# Altium schematic sheet rf.SchDoc
size A4
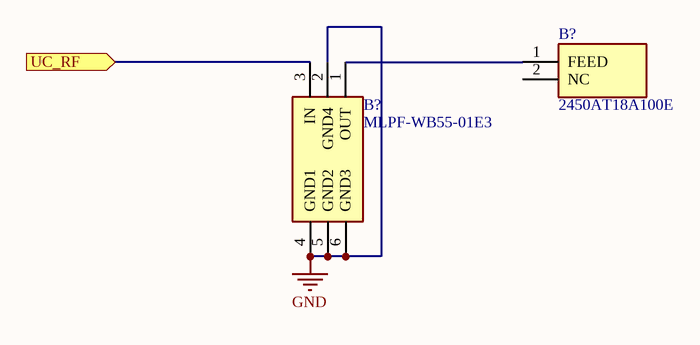
[diagram p0: rf.SchDoc]

## Parts
(Parts that share a designator on the sheet are numbered #1, #2 ... from top to bottom, then left to right.)
B?#1  MLPF-WB55-01E3  [MLPFWB5501E3]
B?#2  2450AT18A100E  [ANTC3216X140N]

## Ports
UC_RF (in)

## Nets
GND: B?#1.2(GND4) B?#1.4(GND1) B?#1.5(GND2) B?#1.6(GND3)
UC_RF: B?#1.3(IN) ; port UC_RF
NetB?#1_1: B?#1.1(OUT) B?#2.1(FEED)

Not connected (* = marked no-connect by the designer): B?#2 2(NC)

## Library data of the parts
B?#1 = MLPF-WB55-01E3: RF Wireless Misc 2.4 GHz Low Pass Filter matched to STM32WB55; Manufacturer_Name: STMicroelectronics; Geometry.Height: 0.7mm; Mouser Part Number: 511-MLPF-WB55-01E3; Mouser Price/Stock: https://www.mouser.co.uk/ProductDetail/STMicroelectronics/MLPF-WB55-01E3?qs=vLWxofP3U2xV%2FkxL9PmCDA%3D%3D; Manufacturer_Part_Number: MLPF-WB55-01E3; Datasheet Link: https://www.st.com/resource/en/datasheet/mlpf-wb55-01e3.pdf
B?#2 = 2450AT18A100E: Antennas 2.45GHz ANTENNA; Manufacturer_Name: JOHANSON TECHNOLOGY; Geometry.Height: 1.4mm; Mouser Part Number: 609-2450AT18A100E; Mouser Price/Stock: https://www.mouser.co.uk/ProductDetail/Johanson-Technology/2450AT18A100E?qs=yCnrNFeXz%252BjzOYKPg7LGCw%3D%3D; Manufacturer_Part_Number: 2450AT18A100E; Datasheet Link: https://www.johansontechnology.com/datasheets/2450AT18A100/2450AT18A100.pdf